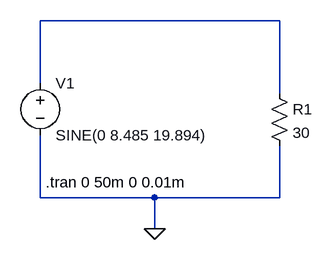
[diagram p0: schematic Lab3_1_1.asc]
Lab3_1_1.asc, the LTspice schematic file:
Version 4
SHEET 1 880 680
WIRE 448 16 80 16
WIRE 80 112 80 16
WIRE 448 128 448 16
WIRE 80 288 80 192
WIRE 256 288 80 288
WIRE 448 288 448 208
WIRE 448 288 256 288
WIRE 256 336 256 288
FLAG 256 336 0
SYMBOL voltage 80 96 R0
WINDOW 123 0 0 Left 0
WINDOW 39 0 0 Left 0
SYMATTR InstName V1
SYMATTR Value SINE(0 8.485 19.894)
SYMBOL res 432 112 R0
SYMATTR InstName R1
SYMATTR Value 30
TEXT 88 264 Left 2 !.tran 0 50m 0 0.01m

The netlist it stands for:
* Lab3_1_1.asc
V1 N001 0 SINE(0 8.485 19.894)
R1 N001 0 30
.tran 0 50m 0 0.01m
.backanno
.end